# EAGLE schematic MPL_Breakout (EAGLE 9.5.2)
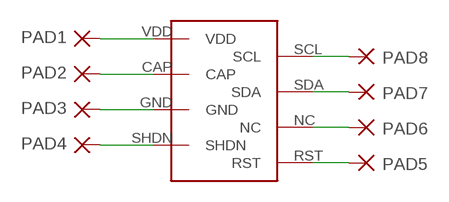
[diagram p0: schematic, sheet 1]

## Parts
B1  MPL115A2T1  [MPL115A2T1]
PAD1  1,6/0,8  [1,6/0,8]
PAD2  1,6/0,8  [1,6/0,8]
PAD3  1,6/0,8  [1,6/0,8]
PAD4  1,6/0,8  [1,6/0,8]
PAD5  1,6/0,8  [1,6/0,8]
PAD6  1,6/0,8  [1,6/0,8]
PAD7  1,6/0,8  [1,6/0,8]
PAD8  1,6/0,8  [1,6/0,8]

## Nets
N$1: B1.VDD PAD1.1(P)
N$2: B1.CAP PAD2.1(P)
N$3: B1.GND PAD3.1(P)
N$4: B1.SHDN PAD4.1(P)
N$5: B1.RST PAD5.1(P)
N$6: B1.NC PAD6.1(P)
N$7: B1.SDA PAD7.1(P)
N$8: B1.SCL PAD8.1(P)

## Library data of the parts
B1 = MPL115A2T1:MPL115A2T1: MEMS Barometer from NXP Semiconductors. DATASHEET: https://www.nxp.com/docs/en/data-sheet/MPL115A2.pdf
PAD1-PAD8 = wirepad:1,6/0,8: THROUGH-HOLE PAD